# EAGLE design UIboard (EAGLE 9.2.2)
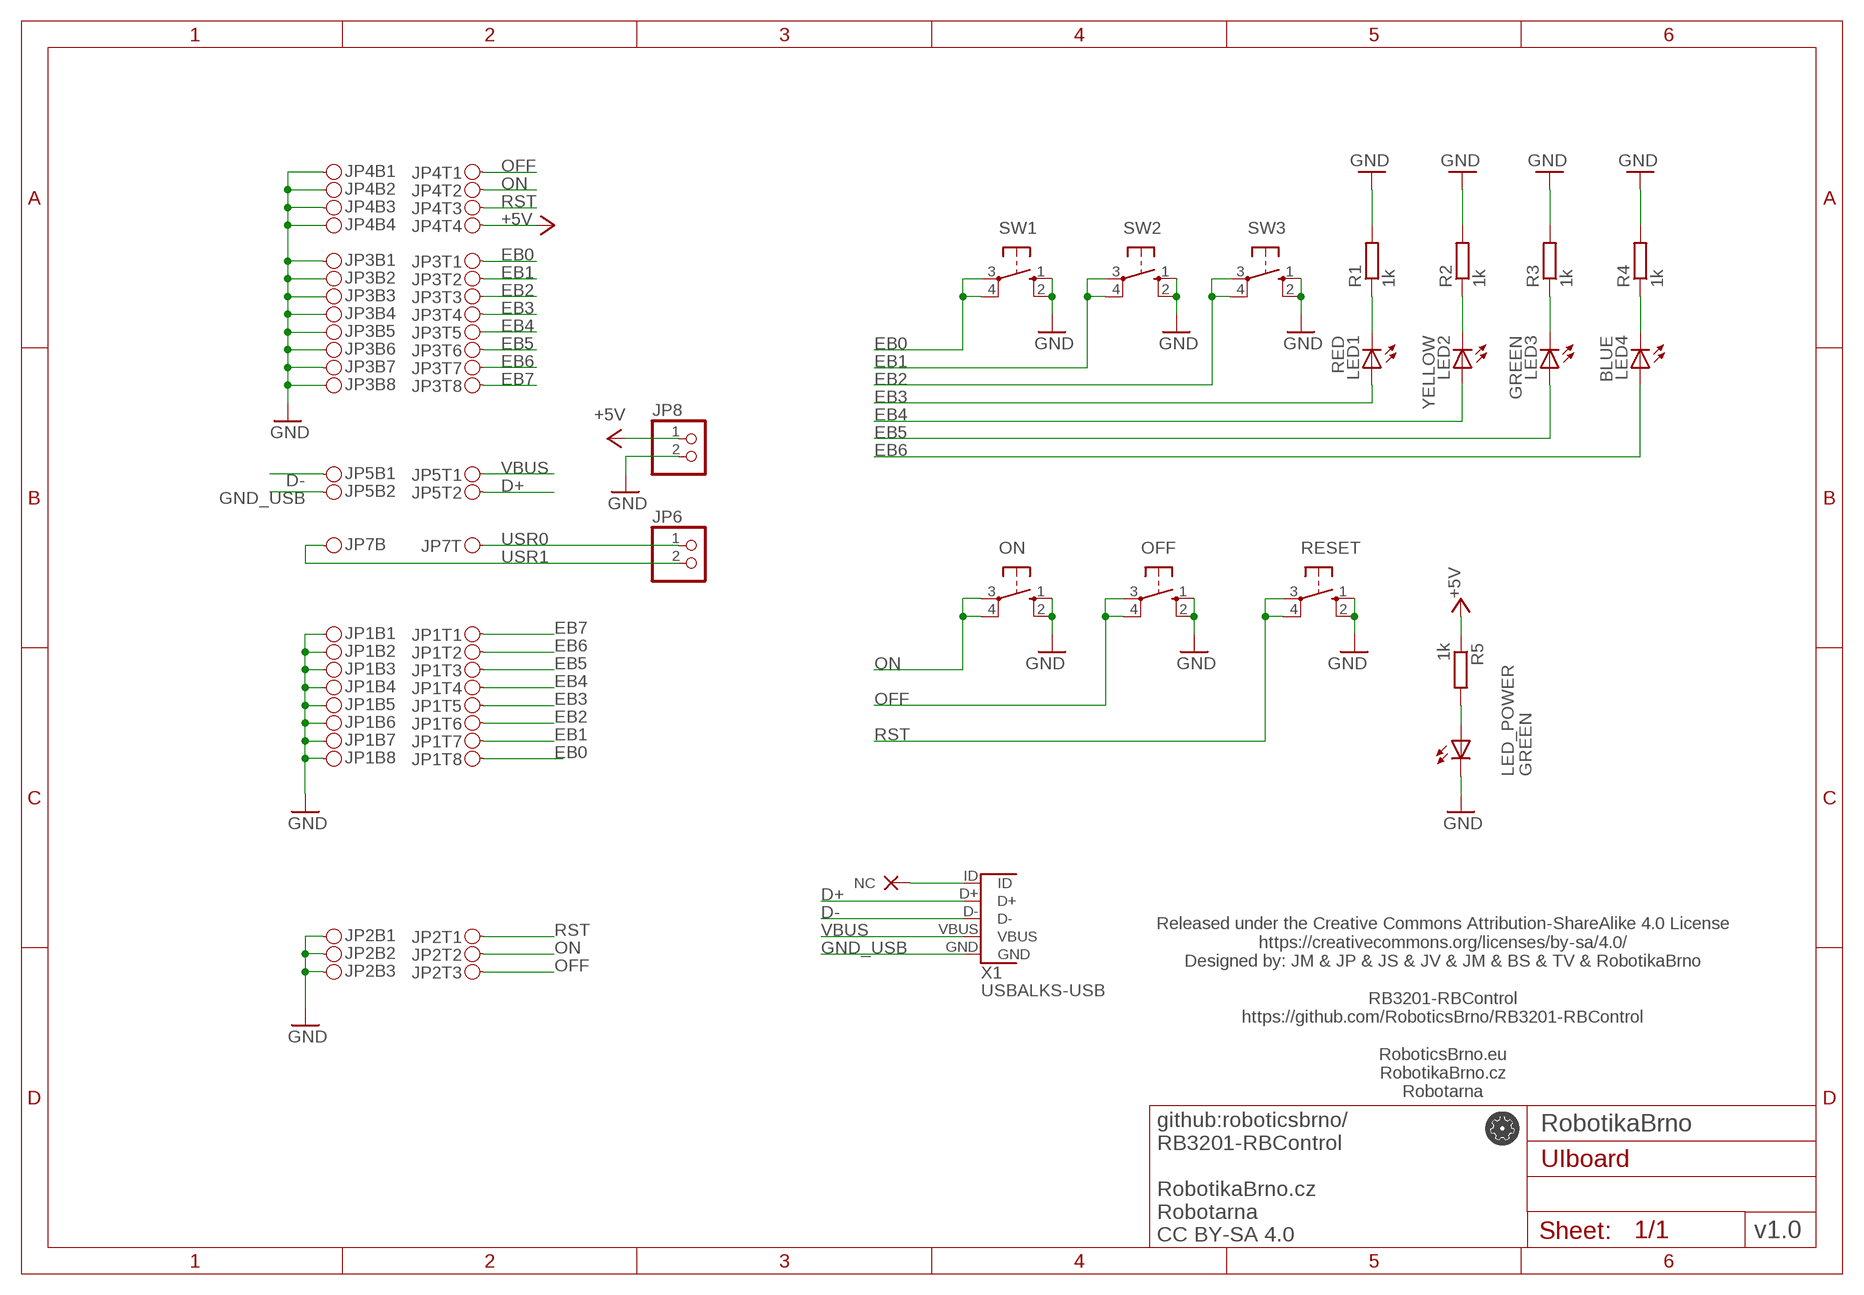
[diagram p0: schematic, sheet 1]

## Parts
JP1  PINH2X08  [PINH2X08SMD]
JP2  PINH2X03  [PINH2X03SMD]
JP3  PINH2X08  [PINH2X08SMD]
JP4  PINH2X04  [PINH2X04SMD]
JP5  PINH2X02  [PINH2X02SMD]
JP6  PINHD-1X2  [1X02]
JP7  PINH2X01  [PINH2X01SMD]
JP8  PINHD-1X2  [1X02]
LED1  RED  LED5MM  [LED5MM]
LED2  YELLOW  LED5MM  [LED5MM]
LED3  GREEN  LED5MM  [LED5MM]
LED4  BLUE  LED5MM  [LED5MM]
LED_POWER  GREEN  LED5MM  [LED5MM]
NC1  NC  (no package)
OFF  10-XX  [B3F-10XX]
ON  10-XX  [B3F-10XX]
R1  1k  R-EU_0204/2V  [0204V]
R2  1k  R-EU_0204/2V  [0204V]
R3  1k  R-EU_0204/2V  [0204V]
R4  1k  R-EU_0204/2V  [0204V]
R5  1k  R-EU_0204/2V  [0204V]
RESET  10-XX  [B3F-10XX]
SW1  10-XX  [B3F-10XX]
SW2  10-XX  [B3F-10XX]
SW3  10-XX  [B3F-10XX]
X1  USBALKS-USB  [ALKS-USB]

## Nets
+5V: JP4.T4 JP8.1 R5.1
D+: JP5.T2 X1.D+
D-: JP5.B1 X1.D-
EB0: JP1.T8 JP3.T1 SW1.3(P) SW1.4(P1)
EB1: JP1.T7 JP3.T2 SW2.3(P) SW2.4(P1)
EB2: JP1.T6 JP3.T3 SW3.3(P) SW3.4(P1)
EB3: JP1.T5 JP3.T4 LED1.A
EB4: JP1.T4 JP3.T5 LED2.A
EB5: JP1.T3 JP3.T6 LED3.A
EB6: JP1.T2 JP3.T7 LED4.A
EB7: JP1.T1 JP3.T8
GND: JP1.B1 JP1.B2 JP1.B3 JP1.B4 JP1.B5 JP1.B6 JP1.B7 JP1.B8 JP2.B1 JP2.B2 JP2.B3 JP3.B1 JP3.B2 JP3.B3 JP3.B4 JP3.B5 JP3.B6 JP3.B7 JP3.B8 JP4.B1 JP4.B2 JP4.B3 JP4.B4 JP8.2 LED_POWER.K(C) OFF.1(S) OFF.2(S1) ON.1(S) ON.2(S1) R1.2 R2.2 R3.2 R4.2 RESET.1(S) RESET.2(S1) SW1.1(S) SW1.2(S1) SW2.1(S) SW2.2(S1) SW3.1(S) SW3.2(S1)
GND_USB: JP5.B2 X1.GND
LED1: LED1.K(C) R1.1
LED2: LED2.K(C) R2.1
LED3: LED3.K(C) R3.1
LED4: LED4.K(C) R4.1
OFF: JP2.T3 JP4.T1 OFF.3(P) OFF.4(P1)
ON: JP2.T2 JP4.T2 ON.3(P) ON.4(P1)
PWRLED: LED_POWER.A R5.2
RST: JP2.T1 JP4.T3 RESET.3(P) RESET.4(P1)
USR0: JP6.1 JP7.T1
USR1: JP6.2 JP7.B1
VBUS: JP5.T1 X1.VBUS
X1ID: NC1.NC X1.ID

## Notes on the sheet
- Released under the Creative Commons Attribution-ShareAlike 4.0 License
  https://creativecommons.org/licenses/by-sa/4.0/
  Designed by: JM & JP & JS & JV & JM & BS & TV & RobotikaBrno
  
  RB3201-RBControl
  https://github.com/RoboticsBrno/RB3201-RBControl
  
  RoboticsBrno.eu
  RobotikaBrno.cz
  Robotarna
- RobotikaBrno
- v1.0
- github:roboticsbrno/
  RB3201-RBControl
  
  RobotikaBrno.cz
  Robotarna
  CC BY-SA 4.0

## Library data of the parts
JP1 JP3 = pinhead_smd:PINH2X08
JP2 = pinhead_smd:PINH2X03
JP4 = pinhead_smd:PINH2X04
JP5 = pinhead_smd:PINH2X02
JP6 JP8 = pinhead:PINHD-1X2: PIN HEADER
JP7 = pinhead_smd:PINH2X01
LED1-LED4 LED_POWER = led:LED: LED OSRAM: - CHIPLED LG R971, LG N971, LY N971, LG Q971, LY Q971, LO R971, LY R971 LH N974, LH R974 LS Q976, LO Q976, LY Q976 LO Q996 - Hyper CHIPLED LW Q18S LB Q993, LB Q99A, LB R99A - SideLED LS A670, LO A670, LY A670, LG A670, LP A670 LB A673, LV A673, LT A673, LW A673 LH A674 LY A675 LS A676, LA A676, LO A676, LY A676, LW A676 LS A679, LY A679, LG A679 - Hyper Micro SIDELED® LS Y876, LA Y876, LO Y876, LY Y876 LT Y87S - SmartLED LW L88C, LW L88S LB L89C, LB L89S, LG L890 LS L89K, LO L89K, LY L89K LS L896, LA L896, LO L896, LY L896 - TOPLED LS T670, LO T670, LY T670, LG T670, LP T670 LSG T670, LSP T670, LSY T670, LOP T670, LYG T670 LG T671, LOG T671, LSG T671 LB T673, LV T673, LT T673, LW T673 LH T674 LS T676, LA T676, LO T676, LY T676, LB T676, LH T676, LSB T676, LW T676 LB T67C, LV T67C, LT T67C, LS T67K, LO T67K, LY T67K, LW E67C LS E67B, LA E67B, LO E67B, LY E67B, LB E67C, LV E67C, LT E67C LW T67C LS T679, LY T679, LG T679 LS T770, LO T770, LY T770, LG T770, LP T770 LB T773, LV T773, LT T773, LW T773 LH T774 LS E675, LA E675, LY E675, LS T675 LS T776, LA T776, LO T776, LY T776, LB T776 LHGB T686 LT T68C, LB T68C - Hyper Mini TOPLED® LB M676 - Mini TOPLED Santana® LG M470 LS M47K, LO M47K, LY M47K Source: http://www.osram.convergy.de LUXEON: - LUMILED® LXK2-PW12-R00, LXK2-PW12-S00, LXK2-PW14-U00, LXK2-PW14-V00 LXK2-PM12-R00, LXK2-PM12-S00, LXK2-PM14-U00 LXK2-PE12-Q00, LXK2-PE12-R00, LXK2-PE12-S00, LXK2-PE14-T00, LXK2-PE14-U00 LXK2-PB12-K00, LXK2-PB12-L00, LXK2-PB12-M00, LXK2-PB14-N00, LXK2-PB14-P00, LXK2-PB14-Q00 LXK2-PR12-L00, LXK2-PR12-M00, LXK2-PR14-Q00, LXK2-PR14-R00 LXK2-PD12-Q00, LXK2-PD12-R00, LXK2-PD12-S00 LXK2-PH12-R00, LXK2-PH12-S00 LXK2-PL12-P00, LXK2-PL12-Q00, LXK2-PL12-R00 Source: www.luxeon.com KINGBRIGHT: KA-3528ASYC Source: www.kingbright.com
NC1 = NC:NC: _EXTERNAL_
OFF ON RESET SW1-SW3 = switch-omron:10-XX: OMRON SWITCH; MPN: B3F-1000; OC_FARNELL: 176432; OC_NEWARK: 36M3542
R1-R5 = resistor:R-EU_: RESISTOR, European symbol
X1 = usb:USB

## Net classes
0 default: width 0.2 mm, drill 0.35 mm, clearance 0.2 mm

## Board
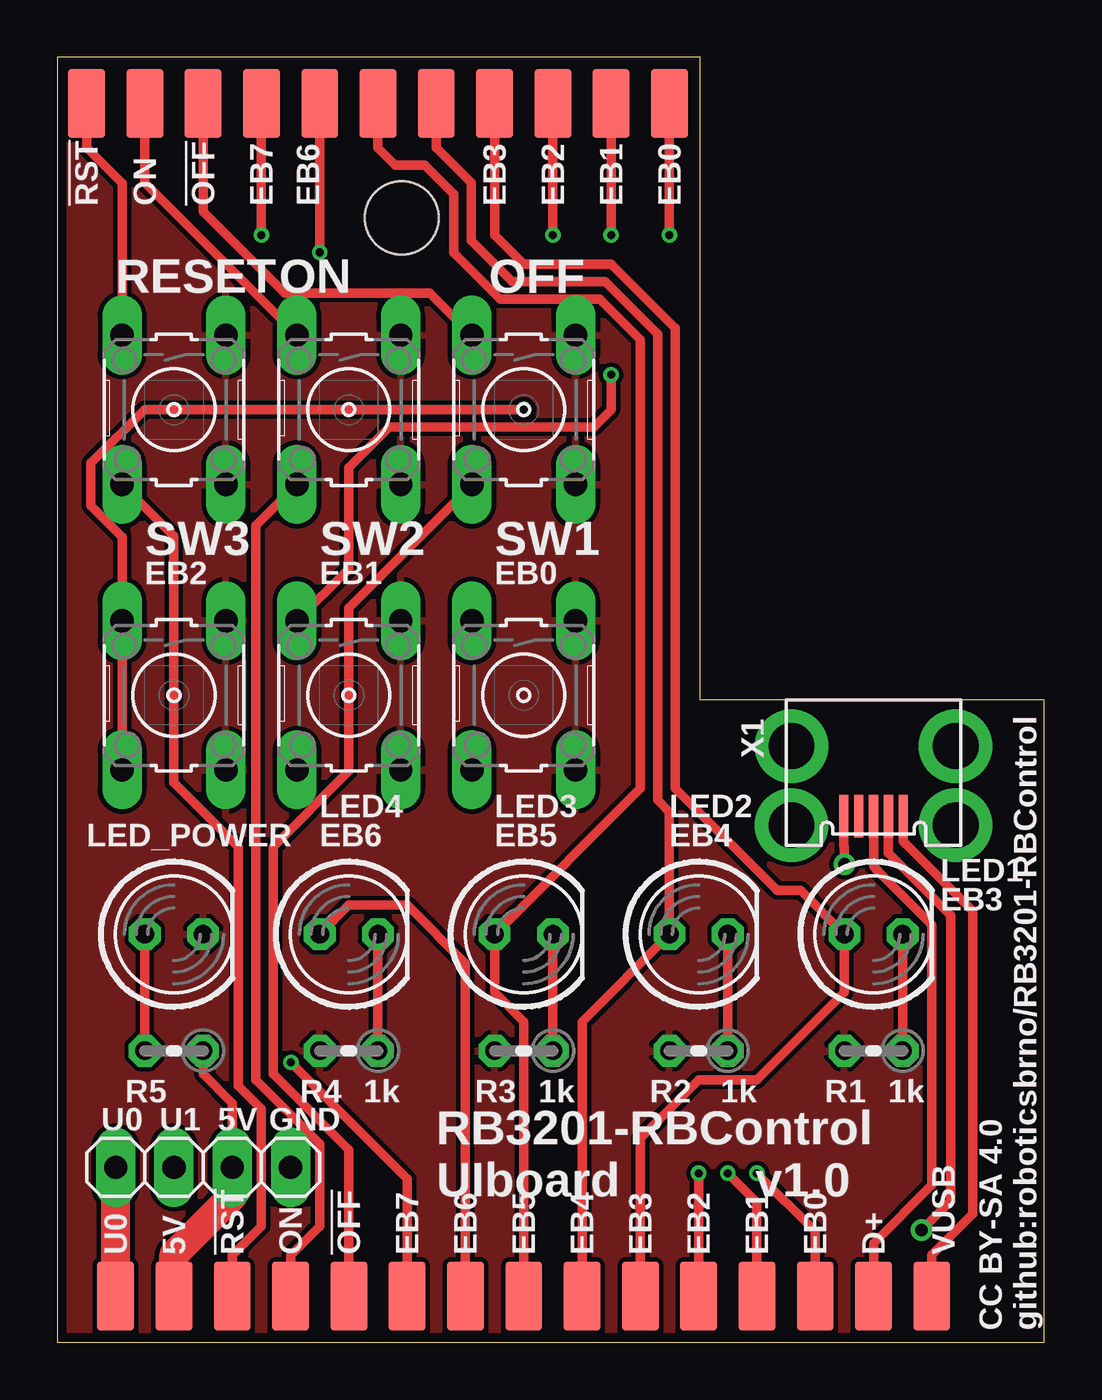
[diagram p1: board, top side]
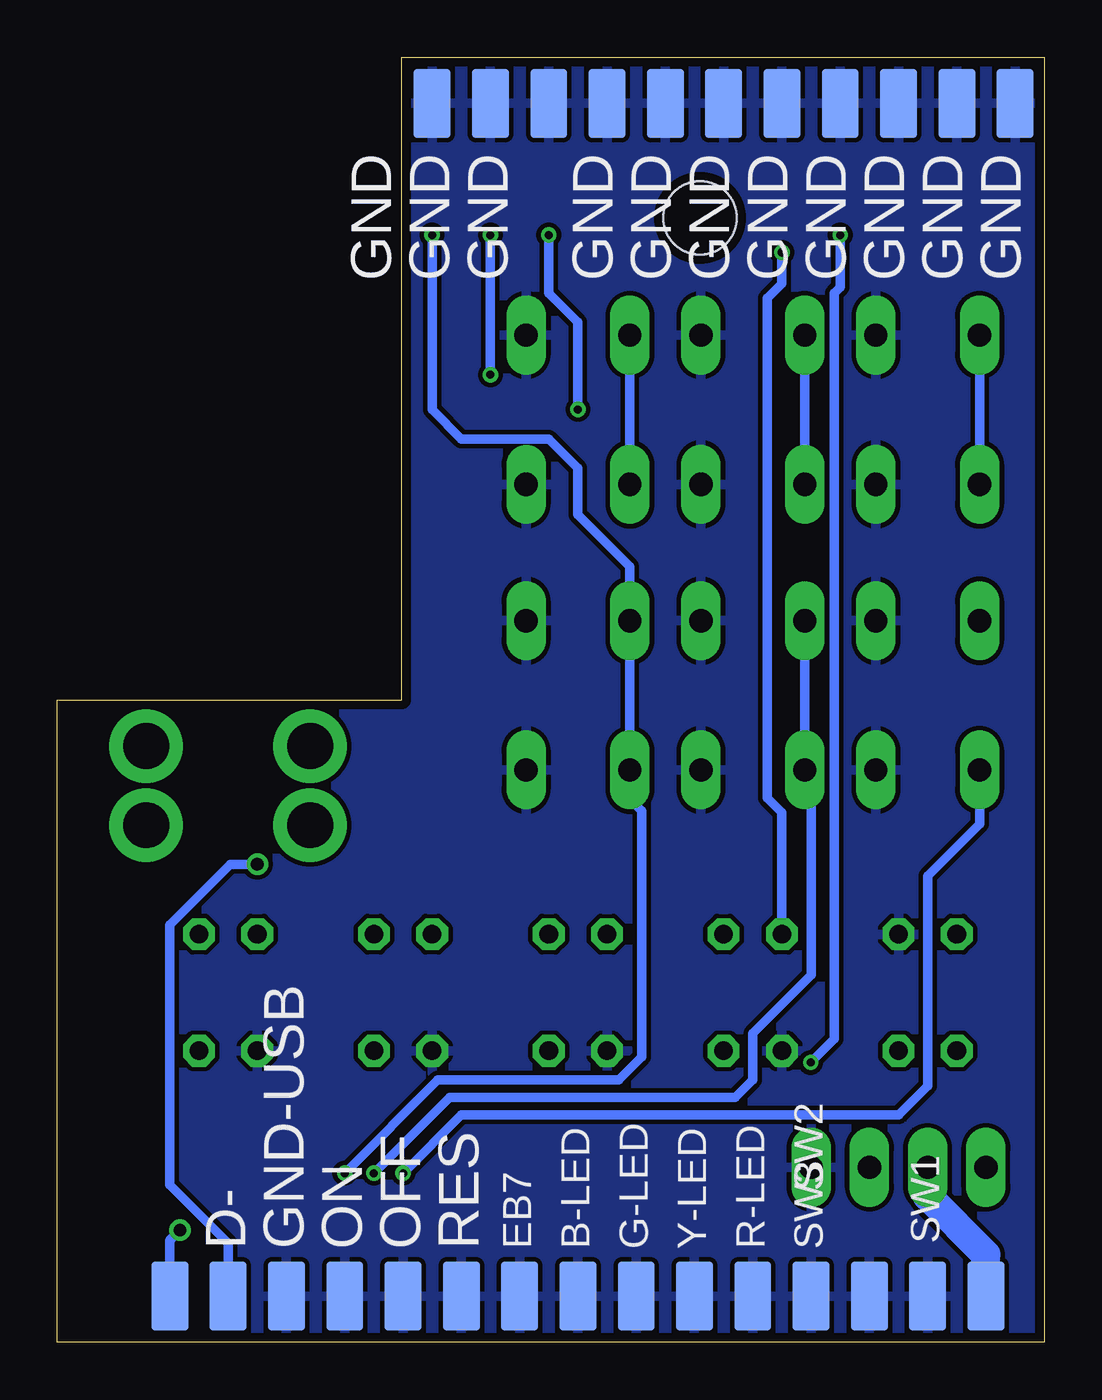
[diagram p2: board, bottom side, seen from below]

Size 43 x 56 mm. Coordinates in mm from the lower left corner, seen from the top.
Outline: 0,0 43,0 43,28 28,28 28,56 0,56 0,0
Copper layers (1*16): Top 0.035mm / dielectric 1.5mm / Bottom 0.035mm
Design rules "robotikabrno *": minimum track width 0.2mm, minimum drill 0.35mm, track to track 0.2mm, track to pad 0.2mm, pad to pad 0.2mm, via to via 0.2mm, smd to smd 0.2mm, copper to edge 0.4mm, drill to drill 0.5mm, minimum pad ring 0.16mm, minimum via ring 0.16mm, stop-mask expansion 0.1mm, vias tented up to drill 0.4mm, thermal gap 0.2mm
Holes 3.2 mm at 15,49
tKeepout: area 11.5,45.5 to 18.5,52.5
bKeepout: area 11.5,45.5 to 18.5,52.5

### Footprints (pad centres in the part's own frame; a part is rotated, then mirrored left to right if it is on the bottom)
PINH2X08SMD = smd 1.6 x 3 bottom: B1 -8.89,-2; B2 -6.35,-2; B3 -3.81,-2; B4 -1.27,-2; B5 1.27,-2; B6 3.81,-2; B7 6.35,-2; B8 8.89,-2 | smd 1.6 x 3: T1 -8.89,-2; T2 -6.35,-2; T3 -3.81,-2; T4 -1.27,-2; T5 1.27,-2; T6 3.81,-2; T7 6.35,-2; T8 8.89,-2
PINH2X03SMD = smd 1.6 x 3 bottom: B1 -2.54,-2; B2 0,-2; B3 2.54,-2 | smd 1.6 x 3: T1 -2.54,-2; T2 0,-2; T3 2.54,-2
PINH2X04SMD = smd 1.6 x 3 bottom: B1 -3.81,-2; B2 -1.27,-2; B3 1.27,-2; B4 3.81,-2 | smd 1.6 x 3: T1 -3.81,-2; T2 -1.27,-2; T3 1.27,-2; T4 3.81,-2
PINH2X02SMD = smd 1.6 x 3 bottom: B1 -1.27,-2; B2 1.27,-2 | smd 1.6 x 3: T1 -1.27,-2; T2 1.27,-2
1X02 = drill 1.016 long: 1 -1.27,0; 2 1.27,0
PINH2X01SMD = smd 1.6 x 3 bottom: B1 0,-2 | smd 1.6 x 3: T1 0,-2
LED5MM = drill 0.813 octagon: A -1.27,0; K 1.27,0
B3F-10XX = drill 1.016 long: 1 -3.251,2.261; 2 3.251,2.261; 3 -3.251,-2.261; 4 3.251,-2.261
0204V = drill 0.813 octagon: 1 -1.27,0; 2 1.27,0
ALKS-USB = smd 1.85 x 0.4: D+ 5.08,0; D- 5.08,0.65; GND 5.08,-1.3; ID 5.08,-0.65; VBUS 5.08,1.3 | drill 2: P$6 2.018,-3.575; P$7 2.018,3.575; P$8 5.468,3.575; P$9 5.468,-3.575

### Placement (x,y rotation side)
JP1  17.78,56 0 top
JP2  3.81,56 0 top
JP3  24.13,0 180 top
JP4  8.89,0 180 top
JP5  36.83,0 180 top
JP6  3.81,7.62 0 top
JP7  2.54,0 180 top
JP8  8.89,7.62 0 top
LED1  35.56,17.78 0 top
LED2  27.94,17.78 0 top
LED3  20.32,17.78 0 top
LED4  12.7,17.78 0 top
LED_POWER  5.08,17.78 0 top
OFF  20.32,40.64 270 top
ON  12.7,40.64 270 top
R1  35.56,12.7 180 top
R2  27.94,12.7 180 top
R3  20.32,12.7 180 top
R4  12.7,12.7 180 top
R5  5.08,12.7 180 top
RESET  5.08,40.64 270 top
SW1  20.32,28.19 270 top
SW2  12.7,28.19 270 top
SW3  5.08,28.19 270 top
X1  35.56,28 270 top

### Tracks (layer width: path | path; a pad name or v marks a point on that pad's centre or on a via)
+5V
  Top 0.406: JP8.1 7.62,10.41 6.35,11.68 R5.1
  Top 1.27: JP4.T4 5.08,3.81 7.62,6.35 JP8.1
D+
  Top 0.406: JP5.T2 35.56,4.32 38.1,6.86 38.1,18.19 35.77,20.53 | 35.77,20.53 35.56,20.73 | 35.77,20.53 35.56,20.73 | 35.56,20.73 X1.D+
D-  (via drill 0.55)
  Top 0.406: v37.66,4.89 38.93,6.16 38.93,18.61 36.21,21.32 X1.D-
  Bottom 0.406: JP5.B1 38.1,4.45 v37.66,4.89
EB0  (via drill 0.35)
  Top 0.406: v30.48,7.37 33.02,4.83 JP3.T1 | v26.67,48.26 JP1.T8
  Bottom 0.406: v26.67,48.26 26.67,40.64 25.4,39.37 21.59,39.37 20.32,38.1 20.32,36.07 18.06,33.81 SW1.3 SW1.4 18.06,23.67 17.53,23.15 17.53,12.44 18.54,11.43 26.42,11.43 v30.48,7.37
EB1  (via drill 0.35)
  Top 0.406: v29.21,7.37 30.48,6.1 JP3.T2 | SW2.3 12.7,33.71 12.7,38.13 14.45,39.88 23.37,39.88 24.13,40.64 v24.13,42.16 | v24.13,48.26 JP1.T7
  Bottom 0.406: SW2.3 SW2.4 10.44,23.67 10.16,23.39 10.16,16 12.7,13.46 12.7,11.43 13.46,10.67 25.91,10.67 v29.21,7.37 | v24.13,48.26 v24.13,42.16
EB2  (via drill 0.35)
  Top 0.406: JP3.T3 v27.94,7.37 | JP1.T6 v21.59,48.26 | v20.32,40.66 3.8,40.66 1.45,38.31 1.45,36.47 2.82,35.1 SW3.3 SW3.4
  Bottom 0.406: v27.94,7.37 25.4,9.91 6.35,9.91 5.08,11.18 5.08,20.32 2.82,22.58 SW3.4 | v21.59,48.26 21.59,45.72 20.32,44.45 v20.32,40.66
EB3
  Top 0.406: JP3.T4 25.4,8.89 27.94,11.43 30.48,11.43 34.29,15.24 LED1.A 32.38,19.68 31.37,19.68 26.92,24.13 26.92,44.2 24.13,46.99 20.32,46.99 19.05,48.26 JP1.T5
EB4
  Top 0.406: JP3.T5 22.86,13.97 LED2.A 26.67,23.11 26.16,23.62 26.16,43.94 23.88,46.23 19.81,46.23 18.03,48.01 18.03,50.55 16.51,52.07 JP1.T4
EB5
  Top 0.406: JP3.T6 20.32,13.97 19.05,15.24 LED3.A 25.4,24.13 25.4,43.69 23.62,45.47 19.3,45.47 17.27,47.5 17.27,50.04 16,51.31 14.73,51.31 13.97,52.07 JP1.T3
EB6  (via drill 0.35)
  Top 0.406: JP3.T7 17.78,16.51 15.24,19.05 12.7,19.05 LED4.A | v11.43,47.5 JP1.T2
  Bottom 0.406: LED4.A 11.43,23.09 12.06,23.72 12.06,45.5 11.43,46.13 v11.43,47.5
EB7  (via drill 0.35)
  Top 0.406: JP1.T1 v8.89,48.26 | JP3.T8 15.24,7.11 10.16,12.19 v10.18,12.19
  Bottom 0.406: v8.89,48.26 8.89,45.97 9.14,45.72 9.14,13.22 v10.18,12.19
GND
  pour Top: 0,55.88 0,0 43.18,0 43.18,55.88
  pour Bottom: 0,55.88 0,0 43.18,0 43.18,55.88
GND_USB  (via drill 0.55)
  Top 0.406: v34.29,20.83 34.29,21.59 34.26,21.62 X1.GND
  Bottom 0.406: JP5.B2 35.56,4.32 38.1,6.86 38.1,18.19 35.46,20.83 v34.29,20.83
LED1
  Top 0.406: R1.1 LED1.K
LED2
  Top 0.406: R2.1 LED2.K
LED3
  Top 0.406: R3.1 LED3.K
LED4
  Top 0.406: R4.1 LED4.K
OFF
  Top 0.406: OFF.3 16.23,45.72 9.91,45.72 6.35,49.28 JP2.T3 | JP4.T1 12.7,8.38 9.4,11.68 9.4,21.59 12.7,24.89 12.7,32 15.24,34.54 18.06,37.36 OFF.4
  Bottom 0.406: OFF.4 OFF.3
ON
  Top 0.406: JP4.T2 10.16,3.78 11.43,5.05 11.43,8.64 8.64,11.43 8.64,35.59 ON.4 | ON.3 10.44,43.92 3.81,50.55 JP2.T2
  Bottom 0.406: ON.4 ON.3
PWRLED
  Top 0.406: R5.2 LED_POWER.A
RST
  Top 0.406: JP4.T3 7.62,3.78 8.89,5.05 8.89,10.16 7.87,11.18 7.87,21.59 5.08,24.38 5.08,35.13 RESET.4 | RESET.3 2.82,50.52 1.27,52.07 JP2.T1
  Bottom 0.406: RESET.4 RESET.3
USR0
  Top 1.27: JP7.T1 JP6.1
USR1
  Bottom 1.27: JP7.B1 2.54,3.81 5.08,6.35 JP6.2
VBUS
  Top 0.406: JP5.T1 38.1,3.81 39.88,5.59 39.88,18.8 36.96,21.72 | 36.86,21.81 36.96,21.72 | 36.96,21.72 36.86,21.81 | 36.86,21.81 X1.VBUS

### Text on the board
tNames: !RST | ON | !OFF | EB7 | EB6 | EB3 | EB2 | EB1 | EB0 | EB2 | EB1 | EB0 | EB6 | EB5 | EB4 | EB3 | U0 | U1 | 5V | GND | RB3201-RBControl / UIboard v1.0 | U0 | 5V | !RST | ON | !OFF | EB7 | EB6 | EB5 | EB4 | EB3 | EB2 | EB1 | EB0 | D+ | VUSB | CC BY-SA 4.0 / github:roboticsbrno/RB3201-RBControl
bNames: GND | GND | GND | GND | GND | GND | GND | GND | GND | GND | GND | SW2 | SW1 | SW3 | R-LED | Y-LED | G-LED | B-LED | EB7 | RES | OFF | ON | GND-USB | D-